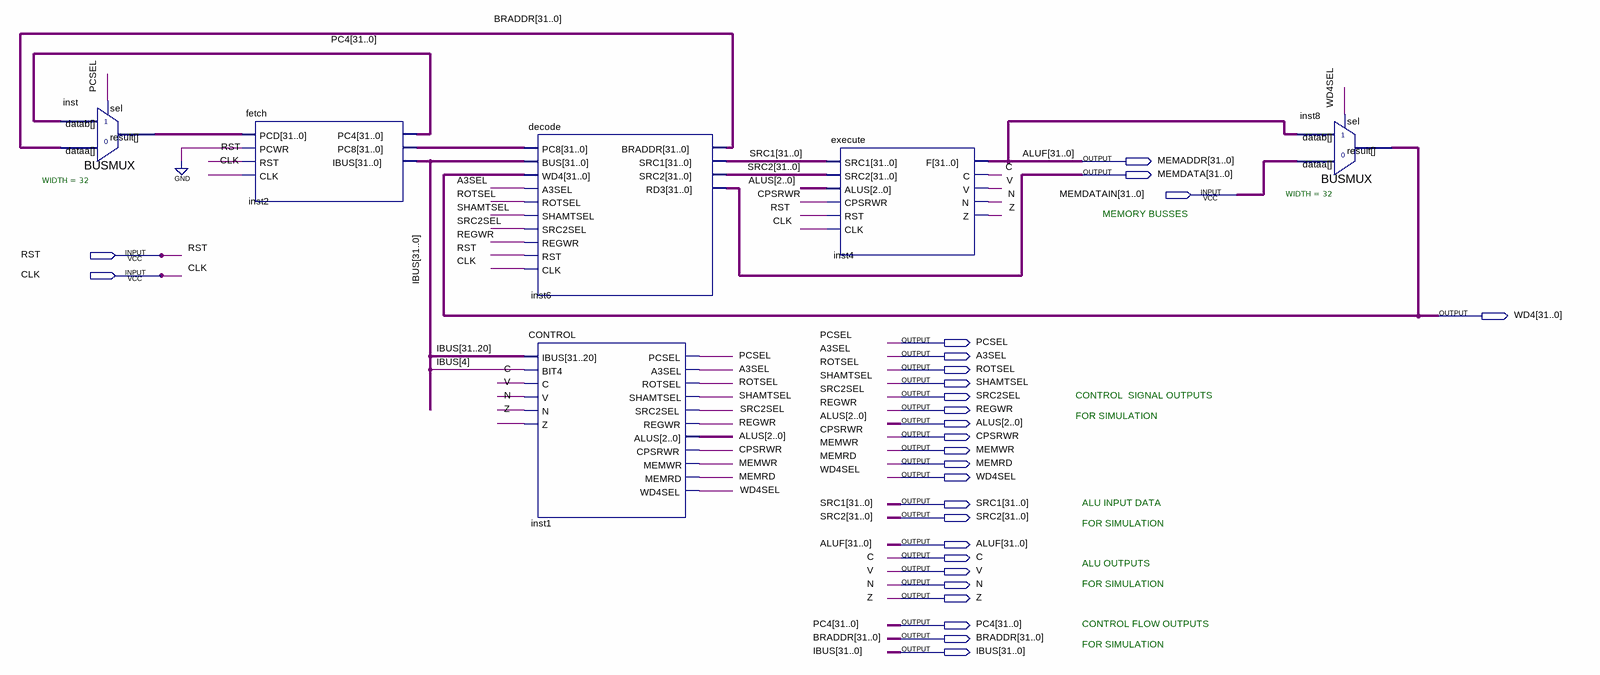
[diagram p0: schematic sheet]
// Quartus schematic scp.bdf as structural Verilog: 6 symbols, 27 pins
module scp (
  input  [31:0] MEMDATAIN,
  input  RST,
  input  CLK,
  output [31:0] MEMADDR,
  output [31:0] MEMDATA,
  output [31:0] WD4,
  output PCSEL,
  output A3SEL,
  output ROTSEL,
  output SHAMTSEL,
  output SRC2SEL,
  output REGWR,
  output [2:0] ALUS,
  output CPSRWR,
  output MEMWR,
  output MEMRD,
  output WD4SEL,
  output [31:0] SRC1,
  output [31:0] SRC2,
  output [31:0] ALUF,
  output C,
  output V,
  output N,
  output Z,
  output [31:0] PC4,
  output [31:0] BRADDR,
  output [31:0] IBUS
);

  wire [31:0] inst2_pc8, inst_result;

  BUSMUX #(.WIDTH(32)) inst (.datab(PC4), .sel(PCSEL), .dataa(BRADDR), .result(inst_result));
  fetch inst2 (.PCD(inst_result), .PCWR(1'b0), .RST(RST), .CLK(CLK), .PC4(PC4), .PC8(inst2_pc8), .IBUS(IBUS));
  decode inst6 (
    .PC8(inst2_pc8), .BUS(IBUS), .WD4(WD4), .A3SEL(A3SEL), .ROTSEL(ROTSEL), .SHAMTSEL(SHAMTSEL),
    .SRC2SEL(SRC2SEL), .REGWR(REGWR), .RST(RST), .CLK(CLK), .BRADDR(BRADDR), .SRC1(SRC1), .SRC2(SRC2),
    .RD3(MEMDATA));
  CONTROL inst1 (
    .IBUS(IBUS[31:20]), .BIT4(IBUS[4]), .C(C), .V(V), .N(N), .Z(Z), .PCSEL(PCSEL), .A3SEL(A3SEL),
    .ROTSEL(ROTSEL), .SHAMTSEL(SHAMTSEL), .SRC2SEL(SRC2SEL), .REGWR(REGWR), .ALUS(ALUS), .CPSRWR(CPSRWR),
    .MEMWR(MEMWR), .MEMRD(MEMRD), .WD4SEL(WD4SEL));
  execute inst4 (
    .SRC1(SRC1), .SRC2(SRC2), .ALUS(ALUS), .CPSRWR(CPSRWR), .RST(RST), .CLK(CLK), .F(ALUF), .C(C), .V(V),
    .N(N), .Z(Z));
  BUSMUX #(.WIDTH(32)) inst8 (.datab(ALUF), .sel(WD4SEL), .dataa(MEMDATAIN), .result(WD4));

  assign MEMADDR = ALUF;

  // Notes on the sheet:
  //   MEMORY BUSSES
  //   CONTROL  SIGNAL OUTPUTS
  //   FOR SIMULATION
  //   ALU INPUT DATA
  //   FOR SIMULATION
  //   ALU OUTPUTS 
  //   FOR SIMULATION
  //   CONTROL FLOW OUTPUTS
  //   FOR SIMULATION
endmodule
